# Altium schematic sheet Sensors.SchDoc
size 594 x 420 mm; SheetNumber: 4; PageSetup: Record=PageOptions|CenterHorizontal=False|CenterVertical=False|PrintScale=0.43|XCorrection=0.00|YCorrection=0.00|PrintKind=1|BorderSize=5000000|LeftOffset=0|BottomOffset=0|Orientation=2|PaperLength=5940|PaperWidth=4200|Scale=100|PaperSource=7|PrintQuality=-4|MediaType=1|DitherType=10|PaperKind=Personal. 1: 215,9 x 279,4 mm|PrintScaleMode=0
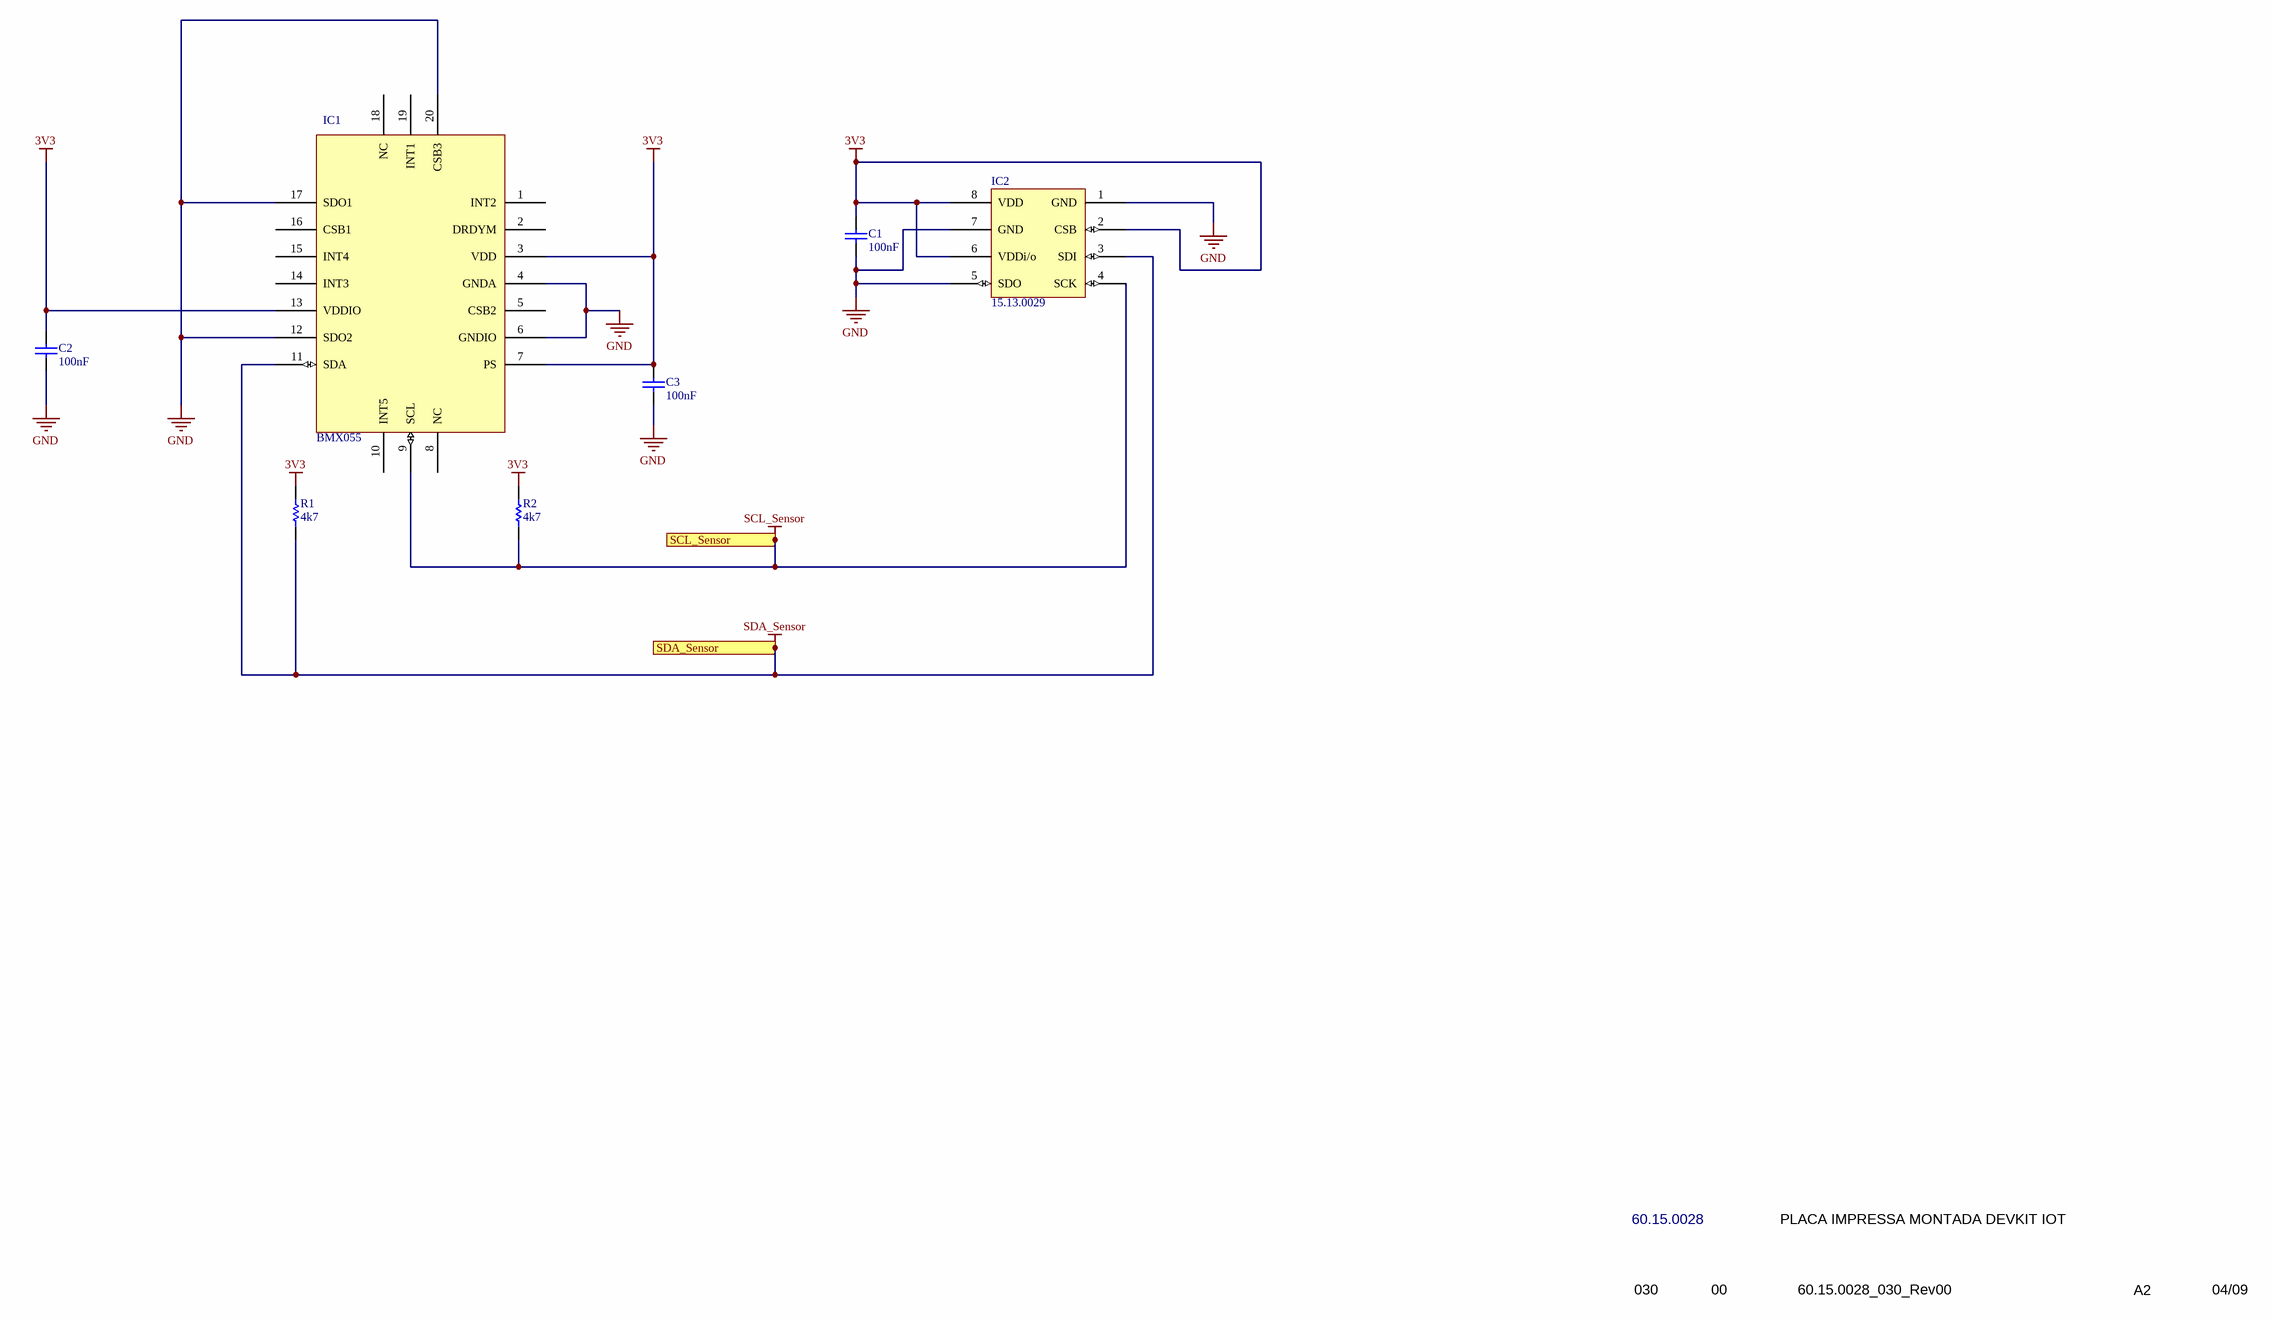
[diagram p0: Sensors.SchDoc]

## Parts
C1  16.23.0333  [16.23.0333]  (value not drawn)
C2  16.23.0333  [16.23.0333]  (value not drawn)
C3  16.23.0333  [16.23.0333]  (value not drawn)
IC1  BMX055  [15.15.0010]
IC2  15.13.0029  [15.13.0029]
R1  value 4k7  [66.24.0659]  (hidden comment: 66.24.0659)
R2  value 4k7  [66.24.0659]  (hidden comment: 66.24.0659)

## Ports
SCL_Sensor, SDA_Sensor

## Nets
3V3: C1.2 C2.2 C3.2 IC1.3(VDD) IC1.7(PS) IC1.13(VDDIO) IC2.2(CSB) IC2.6(VDDi/o) IC2.8(VDD) R1.1 R2.1
GND: C1.1 C2.1 C3.1 IC1.4(GNDA) IC1.6(GNDIO) IC1.12(SDO2) IC1.17(SDO1) IC1.20(CSB3) IC2.1(GND) IC2.5(SDO) IC2.7(GND)
SCL_Sensor: IC1.9(SCL) IC2.4(SCK) R2.2 ; port SCL_Sensor
SDA_Sensor: IC1.11(SDA) IC2.3(SDI) R1.2 ; port SDA_Sensor

Not connected (* = marked no-connect by the designer): IC1 1(INT2) 2(DRDYM) 5(CSB2) 8(NC) 10(INT5) 14(INT3) 15(INT4) 16(CSB1) 18(NC) 19(INT1)

## Notes on the sheet
- 60.15.0028
- PLACA IMPRESSA MONTADA DEVKIT IOT
- 030
- 00
- 60.15.0028_030_Rev00
- A2
- 04/09
- 1
- 2
- 3
- 4
- 5
- 6
- 7
- 8
- A
- B
- C
- D
- E
- F
- G
- H
- DOCUMENTO DE ENGENHARIA DE PRODUTO
- DOCUMENT OF PRODUCT ENGINEERING
- CÓDIGO / CODE
- DESCRIÇÃO / DESCRIPTION
- DOC
- REV
- ARQUIVO / FILE
- FORM./SIZE
- FOLHA / PAGE
- (in symbol 16.23.0333) 100nF

## Library data of the parts
C1-C3 = 16.23.0333: CC 100NF 16V X5R 0402 SMD
IC1 = 15.15.0010: SENSOR ACELEROMETRO MAGNETOMETRO E GIROSCOPIO - BMX055
IC2 = 15.13.0029: SENSOR DE TEMPERATURA UMIDADE E PRESSAO - BME280
R1 R2 = 66.24.0659: RES MET 0,1W 4,7K OHMS 1% 100 PPM 50 V SMD 0603 PBF